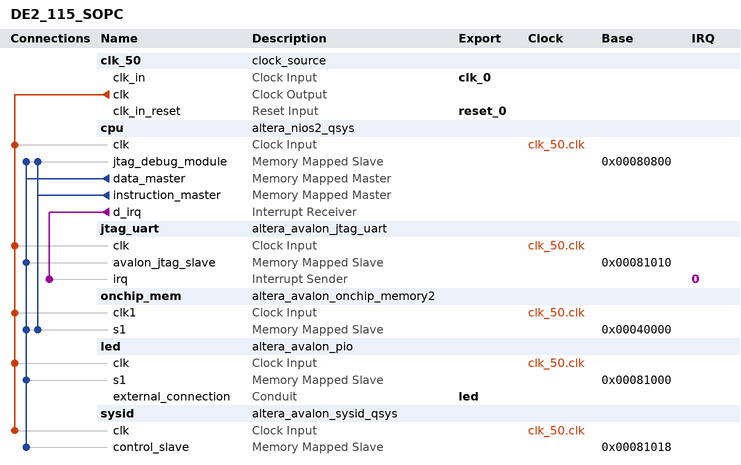
[diagram p0: system contents]
# Platform Designer (Qsys) system DE2_115_SOPC
# Parameters at their usual value, and those the tool derives, are not listed.
package require -exact qsys 10.1
create_system DE2_115_SOPC
set_project_property DEVICE_FAMILY CYCLONEIVE

add_instance clk_50 clock_source 10.1
set_instance_parameter_value clk_50 clockFrequency 50000000

add_instance cpu altera_nios2_qsys 10.1
set_instance_parameter_value cpu manuallyAssignCpuID false
set_instance_parameter_value cpu resetSlave onchip_mem.s1
set_instance_parameter_value cpu exceptionSlave onchip_mem.s1
set_instance_parameter_value cpu breakSlave cpu.jtag_debug_module
set_instance_parameter_value cpu impl Fast
set_instance_parameter_value cpu icache_size 4096

add_instance jtag_uart altera_avalon_jtag_uart 10.1
set_instance_parameter_value jtag_uart simInteractiveOptions INTERACTIVE_ASCII_OUTPUT

add_instance onchip_mem altera_avalon_onchip_memory2 10.1
set_instance_parameter_value onchip_mem dataWidth 32
set_instance_parameter_value onchip_mem dualPort false
set_instance_parameter_value onchip_mem initMemContent true
set_instance_parameter_value onchip_mem initializationFileName onchip_mem
set_instance_parameter_value onchip_mem memorySize 131672

add_instance led altera_avalon_pio 10.1
set_instance_parameter_value led direction Output
set_instance_parameter_value led width 8

add_instance sysid altera_avalon_sysid_qsys 10.1
set_instance_parameter_value sysid id 0

# connections
add_connection clk_50.clk cpu.clk clock
add_connection clk_50.clk jtag_uart.clk clock
add_connection clk_50.clk led.clk clock
add_connection clk_50.clk onchip_mem.clk1 clock
add_connection clk_50.clk sysid.clk clock
add_connection cpu.data_master cpu.jtag_debug_module avalon
set_connection_parameter_value cpu.data_master/cpu.jtag_debug_module baseAddress 0x00080800
add_connection cpu.data_master jtag_uart.avalon_jtag_slave avalon
set_connection_parameter_value cpu.data_master/jtag_uart.avalon_jtag_slave baseAddress 0x00081010
add_connection cpu.data_master led.s1 avalon
set_connection_parameter_value cpu.data_master/led.s1 baseAddress 0x00081000
add_connection cpu.data_master onchip_mem.s1 avalon
set_connection_parameter_value cpu.data_master/onchip_mem.s1 baseAddress 0x00040000
add_connection cpu.data_master sysid.control_slave avalon
set_connection_parameter_value cpu.data_master/sysid.control_slave baseAddress 0x00081018
add_connection cpu.instruction_master cpu.jtag_debug_module avalon
set_connection_parameter_value cpu.instruction_master/cpu.jtag_debug_module baseAddress 0x00080800
add_connection cpu.instruction_master onchip_mem.s1 avalon
set_connection_parameter_value cpu.instruction_master/onchip_mem.s1 baseAddress 0x00040000
add_connection cpu.d_irq jtag_uart.irq interrupt
set_connection_parameter_value cpu.d_irq/jtag_uart.irq irqNumber 0

# exported interfaces
add_interface clk_0 clock sink
set_interface_property clk_0 EXPORT_OF clk_50.clk_in
add_interface reset_0 reset sink
set_interface_property reset_0 EXPORT_OF clk_50.clk_in_reset
add_interface led conduit end
set_interface_property led EXPORT_OF led.external_connection

save_system DE2_115_SOPC.qsys
